# EAGLE design Min328m (EAGLE 7.2.0)
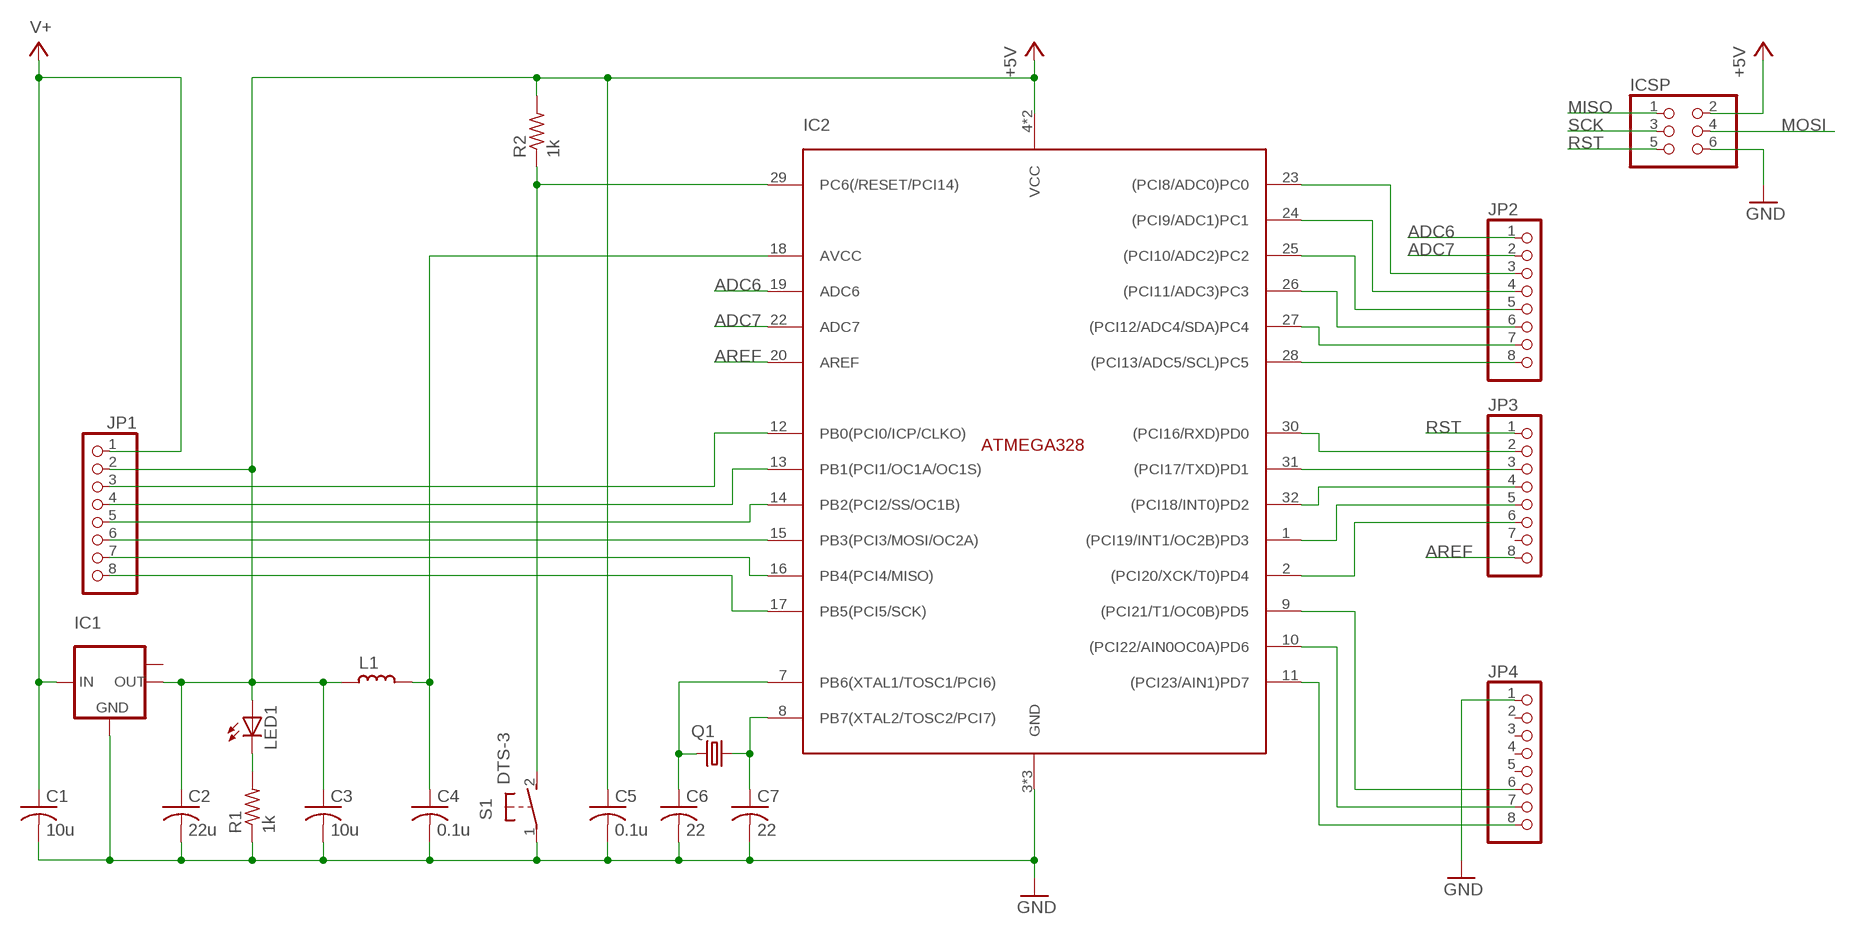
[diagram p0: schematic, sheet 1]

## Parts
C1  10u  C-USC1210K  [C1210K]
C2  22u  C-USC1210K  [C1210K]
C3  10u  C-USC0805K  [C0805K]
C4  0.1u  C-USC0805K  [C0805K]
C5  0.1u  C-USC0805K  [C0805K]
C6  22  C-USC0805K  [C0805K]
C7  22  C-USC0805K  [C0805K]
IC1  LM1117MPX-5.0  [SOT223]
IC2  ATMEGA328P  [TQFP32-08]
ICSP  PINHD-2X3  [2X03]
JP1  PINHD-1X8  [1X08]
JP2  PINHD-1X8  [1X08]
JP3  PINHD-1X8  [1X08]
JP4  PINHD-1X8  [1X08]
L1  L_0805  [L0805]
LED1  LEDCHIPLED_0805  [CHIPLED_0805]
Q1  CRYSTALSM49  [SM49]
R1  1k  R-US_R0805  [R0805]
R2  1k  R-US_R0805  [R0805]
S1  DTS-3  [DTS-3]

## Nets
+5V: C2.1 C3.1 C5.1 IC1.2(OUT) IC2.4(VCC) IC2.6(VCC) ICSP.2 JP1.2 L1.2 LED1.A R2.2
ADC6: IC2.19(ADC6) JP2.1
ADC7: IC2.22(ADC7) JP2.2
AREF: IC2.20(AREF) JP3.8
GND: C1.2 C2.2 C3.2 C4.2 C5.2 C6.2 C7.2 IC1.1(GND) IC2.3(GND) IC2.5(GND) IC2.21(GND) ICSP.6 JP4.1 R1.1 S1.1
MISO: IC2.16(PB4(PCI4/MISO)) ICSP.1 JP1.7
MOSI: IC2.15(PB3(PCI3/MOSI/OC2A)) ICSP.4 JP1.6
N$1: LED1.C R1.2
N$2: IC2.11((PCI23/AIN1)PD7) JP4.8
N$3: IC2.28((PCI13/ADC5/SCL)PC5) JP2.8
N$4: C4.1 IC2.18(AVCC) L1.1
N$5: IC2.10((PCI22/AIN0OC0A)PD6) JP4.7
N$6: IC2.27((PCI12/ADC4/SDA)PC4) JP2.7
N$7: IC2.30((PCI16/RXD)PD0) JP3.2
N$8: IC2.31((PCI17/TXD)PD1) JP3.3
N$9: IC2.32((PCI18/INT0)PD2) JP3.4
N$10: IC2.9((PCI21/T1/OC0B)PD5) JP4.6
N$11: IC2.26((PCI11/ADC3)PC3) JP2.6
N$12: IC2.25((PCI10/ADC2)PC2) JP2.5
N$13: IC2.24((PCI9/ADC1)PC1) JP2.4
N$14: IC2.23((PCI8/ADC0)PC0) JP2.3
N$15: IC2.14(PB2(PCI2/SS/OC1B)) JP1.5
N$16: IC2.13(PB1(PCI1/OC1A/OC1S)) JP1.4
N$17: IC2.12(PB0(PCI0/ICP/CLKO)) JP1.3
N$18: IC2.1((PCI19/INT1/OC2B)PD3) JP3.5
N$19: IC2.2((PCI20/XCK/T0)PD4) JP3.6
RST: IC2.29(PC6(/RESET/PCI14)) ICSP.5 JP3.1 R2.1 S1.2
SCK: IC2.17(PB5(PCI5/SCK)) ICSP.3 JP1.8
V+: C1.1 IC1.3(IN) JP1.1
XTAL1: C6.1 IC2.7(PB6(XTAL1/TOSC1/PCI6)) Q1.2
XTAL2: C7.1 IC2.8(PB7(XTAL2/TOSC2/PCI7)) Q1.1
Unconnected: IC1.TAB(OUT1) JP3.7 JP4.2 JP4.3 JP4.4 JP4.5

## Library data of the parts
C1-C7 = resistor:C-US: CAPACITOR, American symbol
IC1 = lm1117:LM1117MPX-*
IC2 = IC:ATMEGA328P: MICROCONTROLLER 32 kBytes FLASH 2 kBytes SRAM 1 kBytes EEPROM USART 8-channel 10 bit ADC
ICSP = pinhead:PINHD-2X3: PIN HEADER
JP1-JP4 = pinhead:PINHD-1X8: PIN HEADER
L1 = rc-master-smd:L_: INDUCTOR
LED1 = led:LED: LED OSRAM: - CHIPLED LG R971, LG N971, LY N971, LG Q971, LY Q971, LO R971, LY R971 LH N974, LH R974 LS Q976, LO Q976, LY Q976 LO Q996 - Hyper CHIPLED LW Q18S LB Q993, LB Q99A, LB R99A - SideLED LS A670, LO A670, LY A670, LG A670, LP A670 LB A673, LV A673, LT A673, LW A673 LH A674 LY A675 LS A676, LA A676, LO A676, LY A676, LW A676 LS A679, LY A679, LG A679 - Hyper Micro SIDELED® LS Y876, LA Y876, LO Y876, LY Y876 LT Y87S - SmartLED LW L88C, LW L88S LB L89C, LB L89S, LG L890 LS L89K, LO L89K, LY L89K LS L896, LA L896, LO L896, LY L896 - TOPLED LS T670, LO T670, LY T670, LG T670, LP T670 LSG T670, LSP T670, LSY T670, LOP T670, LYG T670 LG T671, LOG T671, LSG T671 LB T673, LV T673, LT T673, LW T673 LH T674 LS T676, LA T676, LO T676, LY T676, LB T676, LH T676, LSB T676, LW T676 LB T67C, LV T67C, LT T67C, LS T67K, LO T67K, LY T67K, LW E67C LS E67B, LA E67B, LO E67B, LY E67B, LB E67C, LV E67C, LT E67C LW T67C LS T679, LY T679, LG T679 LS T770, LO T770, LY T770, LG T770, LP T770 LB T773, LV T773, LT T773, LW T773 LH T774 LS E675, LA E675, LY E675, LS T675 LS T776, LA T776, LO T776, LY T776, LB T776 LHGB T686 LT T68C, LB T68C - Hyper Mini TOPLED® LB M676 - Mini TOPLED Santana® LG M470 LS M47K, LO M47K, LY M47K Source: http://www.osram.convergy.de LUXEON: - LUMILED® LXK2-PW12-R00, LXK2-PW12-S00, LXK2-PW14-U00, LXK2-PW14-V00 LXK2-PM12-R00, LXK2-PM12-S00, LXK2-PM14-U00 LXK2-PE12-Q00, LXK2-PE12-R00, LXK2-PE12-S00, LXK2-PE14-T00, LXK2-PE14-U00 LXK2-PB12-K00, LXK2-PB12-L00, LXK2-PB12-M00, LXK2-PB14-N00, LXK2-PB14-P00, LXK2-PB14-Q00 LXK2-PR12-L00, LXK2-PR12-M00, LXK2-PR14-Q00, LXK2-PR14-R00 LXK2-PD12-Q00, LXK2-PD12-R00, LXK2-PD12-S00 LXK2-PH12-R00, LXK2-PH12-S00 LXK2-PL12-P00, LXK2-PL12-Q00, LXK2-PL12-R00 Source: www.luxeon.com KINGBRIGHT: KA-3528ASYC Source: www.kingbright.com
Q1 = crystal:CRYSTAL: CRYSTAL; OC_FARNELL: unknown; OC_NEWARK: unknown
R1 R2 = resistor:R-US_: RESISTOR, American symbol
S1 = switch-tact:DTS-3

## Board
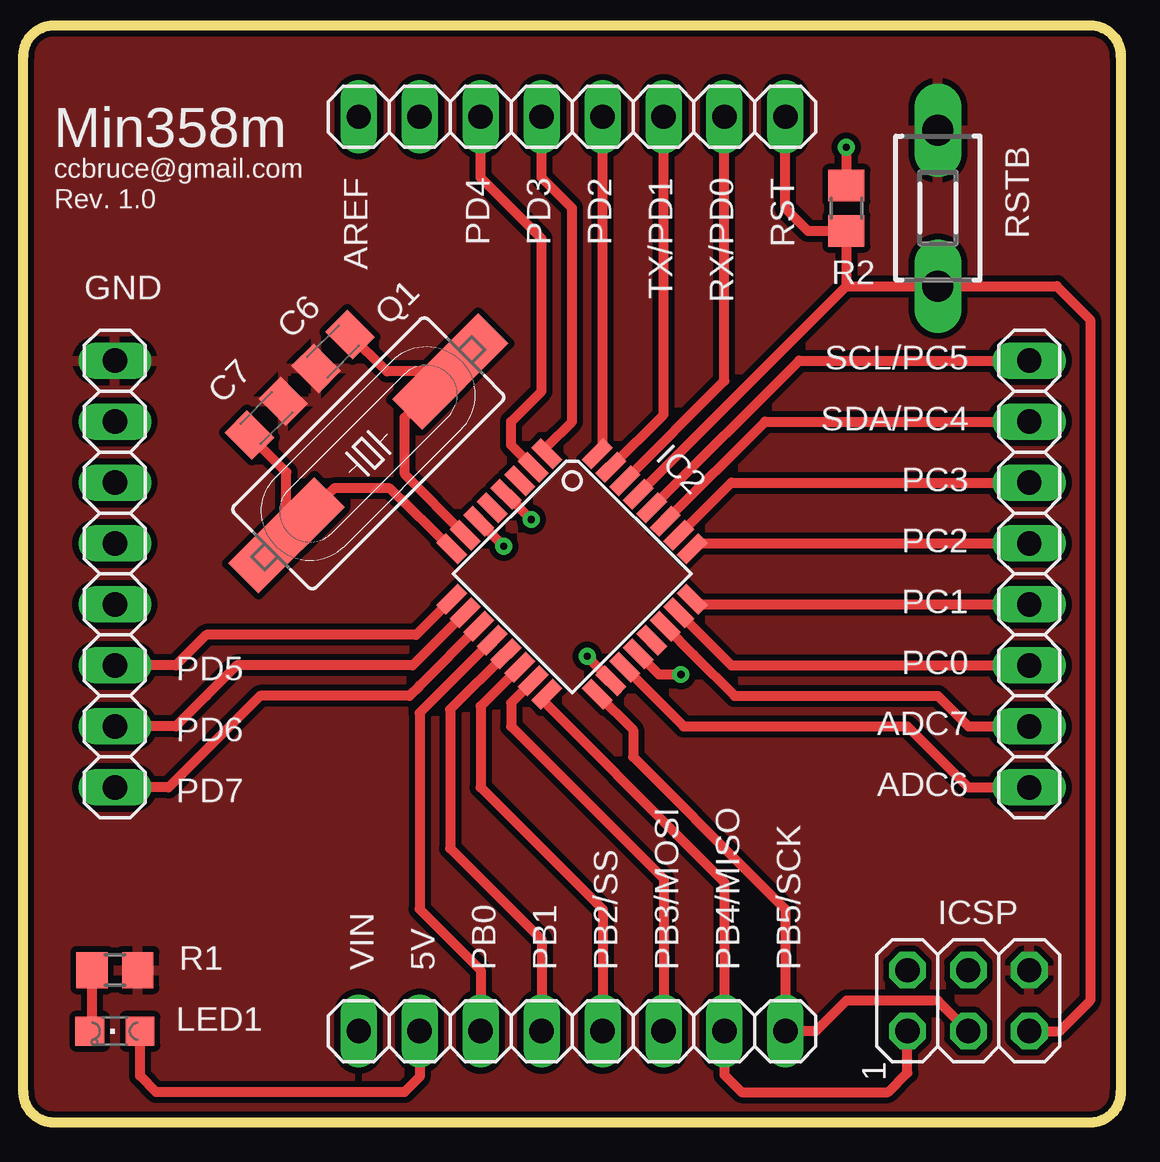
[diagram p1: board, top side]
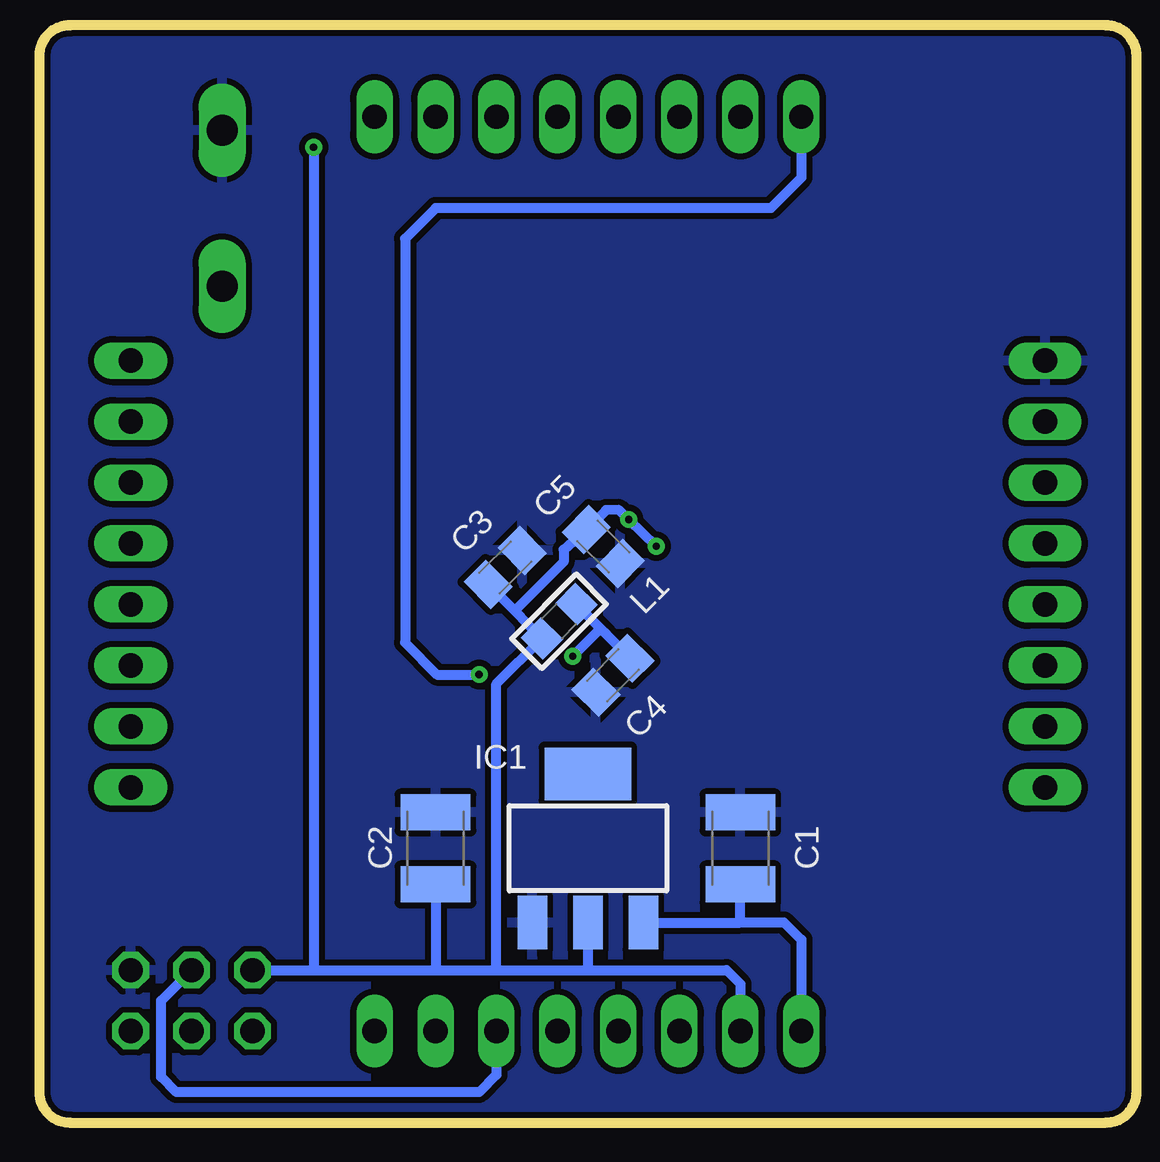
[diagram p2: board, bottom side, seen from below]

No outline drawn. Coordinates in mm, seen from the top.
Copper layers (1*16): Top 0.035mm / dielectric 1.5mm / Bottom 0.035mm
Design rules "default *": minimum track width 10mil, minimum drill 24mil, track to track 8mil, track to pad 8mil, pad to pad 8mil, via to via 8mil, smd to smd 8mil, copper to edge 40mil, drill to drill 8mil, minimum pad ring 10mil, minimum via ring 8mil, stop-mask expansion 4mil, vias tented up to drill 0.5mm, thermal gap 10mil
tRestrict: 8 lines
bRestrict: 8 lines
Milling: 8 lines

### Footprints (pad centres in the part's own frame; a part is rotated, then mirrored left to right if it is on the bottom)
C1210K = smd 1.5 x 2.9: 1 -1.5,0; 2 1.5,0
C0805K = smd 1.3 x 1.6: 1 -1,0; 2 1,0
SOT223 = smd 1.219 x 2.235: 1 -2.311,-3.099; 2 0,-3.099; 3 2.311,-3.099 | smd 3.6 x 2.2: TAB 0,3.099
TQFP32-08 = smd 1.27 x 0.559: 1 -4.293,2.8; 2 -4.293,2; 3 -4.293,1.2; 4 -4.293,0.4; 5 -4.293,-0.4; 6 -4.293,-1.2; 7 -4.293,-2; 8 -4.293,-2.8; 17 4.293,-2.8; 18 4.293,-2; 19 4.293,-1.2; 20 4.293,-0.4; 21 4.293,0.4; 22 4.293,1.2; 23 4.293,2; 24 4.293,2.8 | smd 0.559 x 1.27: 9 -2.8,-4.293; 10 -2,-4.293; 11 -1.2,-4.293; 12 -0.4,-4.293; 13 0.4,-4.293; 14 1.2,-4.293; 15 2,-4.293; 16 2.8,-4.293; 25 2.8,4.293; 26 2,4.293; 27 1.2,4.293; 28 0.4,4.293; 29 -0.4,4.293; 30 -1.2,4.293; 31 -2,4.293; 32 -2.8,4.293
2X03 = drill 1.016 octagon: 1 -2.54,-1.27; 2 -2.54,1.27; 3 0,-1.27; 4 0,1.27; 5 2.54,-1.27; 6 2.54,1.27
1X08 = drill 1.016 long: 1 -8.89,0; 2 -6.35,0; 3 -3.81,0; 4 -1.27,0; 5 1.27,0; 6 3.81,0; 7 6.35,0; 8 8.89,0
L0805 = smd 1.2 x 1.3: 1 -1.016,0; 2 1.016,0
CHIPLED_0805 = smd 1.2 x 1.2: A 0,-1.05; C 0,1.05
SM49 = smd 5.08 x 1.778: 1 -4.826,0; 2 4.826,0
R0805 = smd 1.3 x 1.5: 1 -0.95,0; 2 0.95,0
DTS-3 = drill 1.3 long: 1 -3.25,0; 2 3.25,0

### Placement (x,y rotation side)
C1  16.51,11.43 90 bottom
C2  29.21,11.43 90 bottom
C3  26.31,23.13 45 bottom
C4  21.82,18.64 225 bottom
C5  22.23,24 315 bottom
C6  12.9,32.13 225 top
C7  10.12,29.36 45 top
IC1  22.86,11.43 0 bottom
IC2  22.86,22.86 315 top
ICSP  39.37,5.08 0 top
JP1  22.86,3.81 0 top
JP2  41.91,22.86 90 top
JP3  22.86,41.91 180 top
JP4  3.81,22.86 270 top
L1  24.06,20.89 225 bottom
LED1  3.81,3.81 90 top
Q1  14.37,27.89 45 top
R1  3.81,6.35 180 top
R2  34.29,38.1 90 top
S1  38.1,38.1 270 top

### Tracks (layer width: path | path; a pad name or v marks a point on that pad's centre or on a via)
+5V  (via drill 0.3)
  Top 0.406: v34.29,40.64 R2.2 | v21.16,25.13 IC2.4 | v20.01,24.01 IC2.6 | JP1.2 16.51,1.91 15.88,1.27 5.53,1.27 4.86,1.94 LED1.A
  Bottom 0.406: 29.21,6.35 26.67,6.35 | 26.67,6.35 22.86,6.35 | 22.86,6.35 17.08,6.35 16.51,5.78 JP1.2 | ICSP.2 34.29,6.35 | 34.29,6.35 29.21,6.35 | v34.29,40.64 34.29,6.35 | IC1.2 22.86,6.35 | C2.1 29.21,6.35 | v20.01,24.01 v21.16,25.13 21.58,25.53 22.11,25.52 C5.1 23.88,23.88 23.88,23.37 25.91,21.34 | 26.67,6.35 26.67,18.28 L1.2 25.91,21.34 | C3.1 25.91,21.34
ADC6
  Top 0.406: IC2.19 27.51,16.51 36.83,16.51 39.37,13.97 JP2.1
ADC7
  Top 0.406: IC2.22 27.94,19.48 29.64,17.78 38.1,17.78 39.37,16.51 JP2.2
AREF  (via drill 0.3)
  Top 0.406: v27.4,18.67 26.48,18.67 IC2.20
  Bottom 0.406: JP3.8 13.97,39.37 15.24,38.1 29.21,38.1 30.48,36.83 30.48,20 29.16,18.67 v27.4,18.67
GND
  pour Top (isolate 0.254): -2.54,46.99 48.26,46.99 48.26,-1.27 -2.54,-1.27
  pour Bottom (isolate 0.254): -2.54,46.99 48.26,46.99 48.26,-1.27 -2.54,-1.27
MISO
  Top 0.406: ICSP.1 36.83,2.07 36.03,1.27 29.93,1.27 29.21,1.99 JP1.7 29.21,10.01 27.79,11.43 21.59,17.63 IC2.16
MOSI
  Top 0.406: IC2.15 20.32,17.49 20.32,16.51 26.67,10.16 JP1.6
  Bottom 0.406: JP1.6 26.67,1.99 27.39,1.27 40.01,1.27 40.64,1.91 40.64,5.08 ICSP.4
N$1
  Top 0.406: LED1.C 2.86,3.81 R1.2
N$2
  Top 0.406: IC2.11 16.51,18.21 16.08,17.78 9.86,17.78 8.89,16.81 6.05,13.97 JP4.8
N$3
  Top 0.406: IC2.28 32.32,31.75 JP2.8
N$4  (via drill 0.3)
  Top 0.406: IC2.18 v23.5,19.43
  Bottom 0.406: C4.1 22.08,20.33 | 22.08,20.33 L1.1 | v23.5,19.43 22.34,20.59 22.08,20.33
N$5
  Top 0.406: IC2.10 16.51,19.34 16.22,19.05 8.89,19.05 7.62,17.78 6.35,16.51 JP4.7
N$6
  Top 0.406: IC2.27 30.91,29.21 JP2.7
N$7
  Top 0.406: IC2.30 29.21,30.91 JP3.2
N$8
  Top 0.406: IC2.31 26.67,29.5 JP3.3
N$9
  Top 0.406: IC2.32 24.13,28.09 JP3.4
N$10
  Top 0.406: IC2.9 16.51,20.47 16.36,20.32 7.62,20.32 6.35,19.05 JP4.6
N$11
  Top 0.406: IC2.26 29.5,26.67 JP2.6
N$12
  Top 0.406: IC2.25 28.09,24.13 JP2.5
N$13
  Top 0.406: IC2.24 28.09,21.59 JP2.4
N$14
  Top 0.406: IC2.23 29.21,19.34 29.5,19.05 JP2.3
N$15
  Top 0.406: IC2.14 19.05,17.35 19.05,13.97 24.13,8.89 JP1.5
N$16
  Top 0.406: IC2.13 17.78,17.21 17.78,11.43 21.59,7.62 JP1.4
N$17
  Top 0.406: IC2.12 16.51,17.08 16.51,8.89 19.05,6.35 JP1.3
N$18
  Top 0.406: IC2.1 21.8,28.16 22.86,29.21 22.86,38.1 21.59,39.37 JP3.5
N$19
  Top 0.406: IC2.2 20.32,28.23 20.32,29.21 21.59,30.48 21.59,36.83 19.05,39.37 JP3.6
RST
  Top 0.406: ICSP.5 43.18,3.81 44.45,5.08 44.45,33.46 43.06,34.85 S1.2 34.29,34.85 | 34.29,34.85 R2.1 32.7,37.15 31.75,38.1 JP3.1 | IC2.29 34.28,34.85 34.29,34.85
SCK
  Top 0.406: ICSP.3 38.1,5.08 34.29,5.08 33.02,3.81 JP1.8 31.75,8.89 30.48,10.16 25.4,15.24 25.4,16.36 IC2.17
V+
  Bottom 0.406: IC1.3 16.51,8.33 | 16.51,8.33 C1.1 | 16.51,8.33 14.68,8.33 13.97,7.62 JP1.1
XTAL1
  Top 0.406: IC2.7 15.89,27.02 15.89,29.37 Q1.2 15.15,31.3 C6.1
XTAL2
  Top 0.406: IC2.8 15.26,26.43 12.94,26.42 Q1.1 10.96,27.11 C7.1

### Text on the board
tNames: Min358m | ccbruce@gmail.com | AREF | PD4 | PD3 | PD2 | TX/PD1 | RX/PD0 | RST | Rev. 1.0 | RSTB | GND | SCL/PC5 | SDA/PC4 | PC3 | PC2 | PC1 | PC0 | PD5 | ADC7 | PD6 | ADC6 | PD7 | VIN | 5V | PB0 | PB1 | PB2/SS | PB3/MOSI | PB4/MISO | PB5/SCK | 1